# EAGLE design flightcontroller (EAGLE 9.5.2)
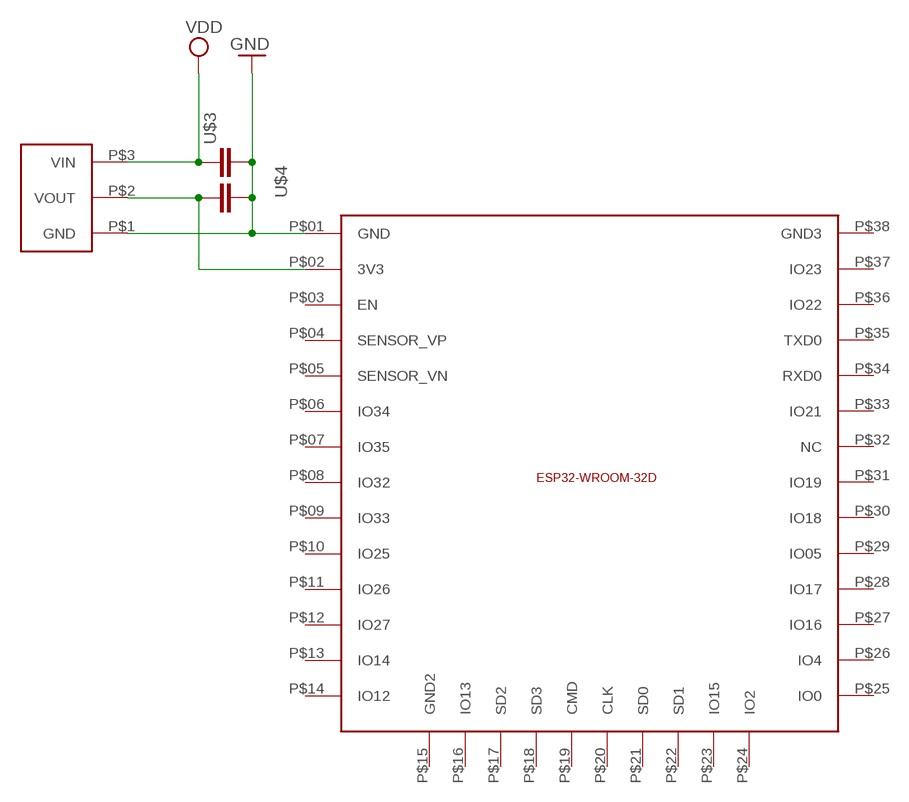
[diagram p0: schematic, sheet 1]

## Parts
U$1  ESP32  [ESP32-WROOM-32D]
U$2  REG1117  [REG1117]
U$3  C_TANTALUM-1411(3528-METRIC)  [CAPM3528X210]
U$4  C_TANTALUM-1411(3528-METRIC)  [CAPM3528X210]

## Nets
GND: U$1.P$01(GND) U$2.P$1(GND) U$3.2 U$4.2
N$2: U$1.P$02(3V3) U$2.P$2(VOUT) U$4.1
VDD: U$2.P$3(VIN) U$3.1
Unconnected: U$1.P$03(EN) U$1.P$04(SENSOR_VP) U$1.P$05(SENSOR_VN) U$1.P$06(IO34) U$1.P$07(IO35) U$1.P$08(IO32) U$1.P$09(IO33) U$1.P$10(IO25) U$1.P$11(IO26) U$1.P$12(IO27) U$1.P$13(IO14) U$1.P$14(IO12) U$1.P$15(GND2) U$1.P$16(IO13) U$1.P$17(SD2) U$1.P$18(SD3) U$1.P$19(CMD) U$1.P$20(CLK) U$1.P$21(SD0) U$1.P$22(SD1) U$1.P$23(IO15) U$1.P$24(IO2) U$1.P$25(IO0) U$1.P$26(IO4) U$1.P$27(IO16) U$1.P$28(IO17) U$1.P$29(IO05) U$1.P$30(IO18) U$1.P$31(IO19) U$1.P$32(NC) U$1.P$33(IO21) U$1.P$34(RXD0) U$1.P$35(TXD0) U$1.P$36(IO22) U$1.P$37(IO23) U$1.P$38(GND3)

## Library data of the parts
U$1 = FlightController:ESP32
U$2 = REG1117:REG1117
U$3 U$4 = Capacitor:C: Capacitor - Generic; CATEGORY: Capacitor

## Board
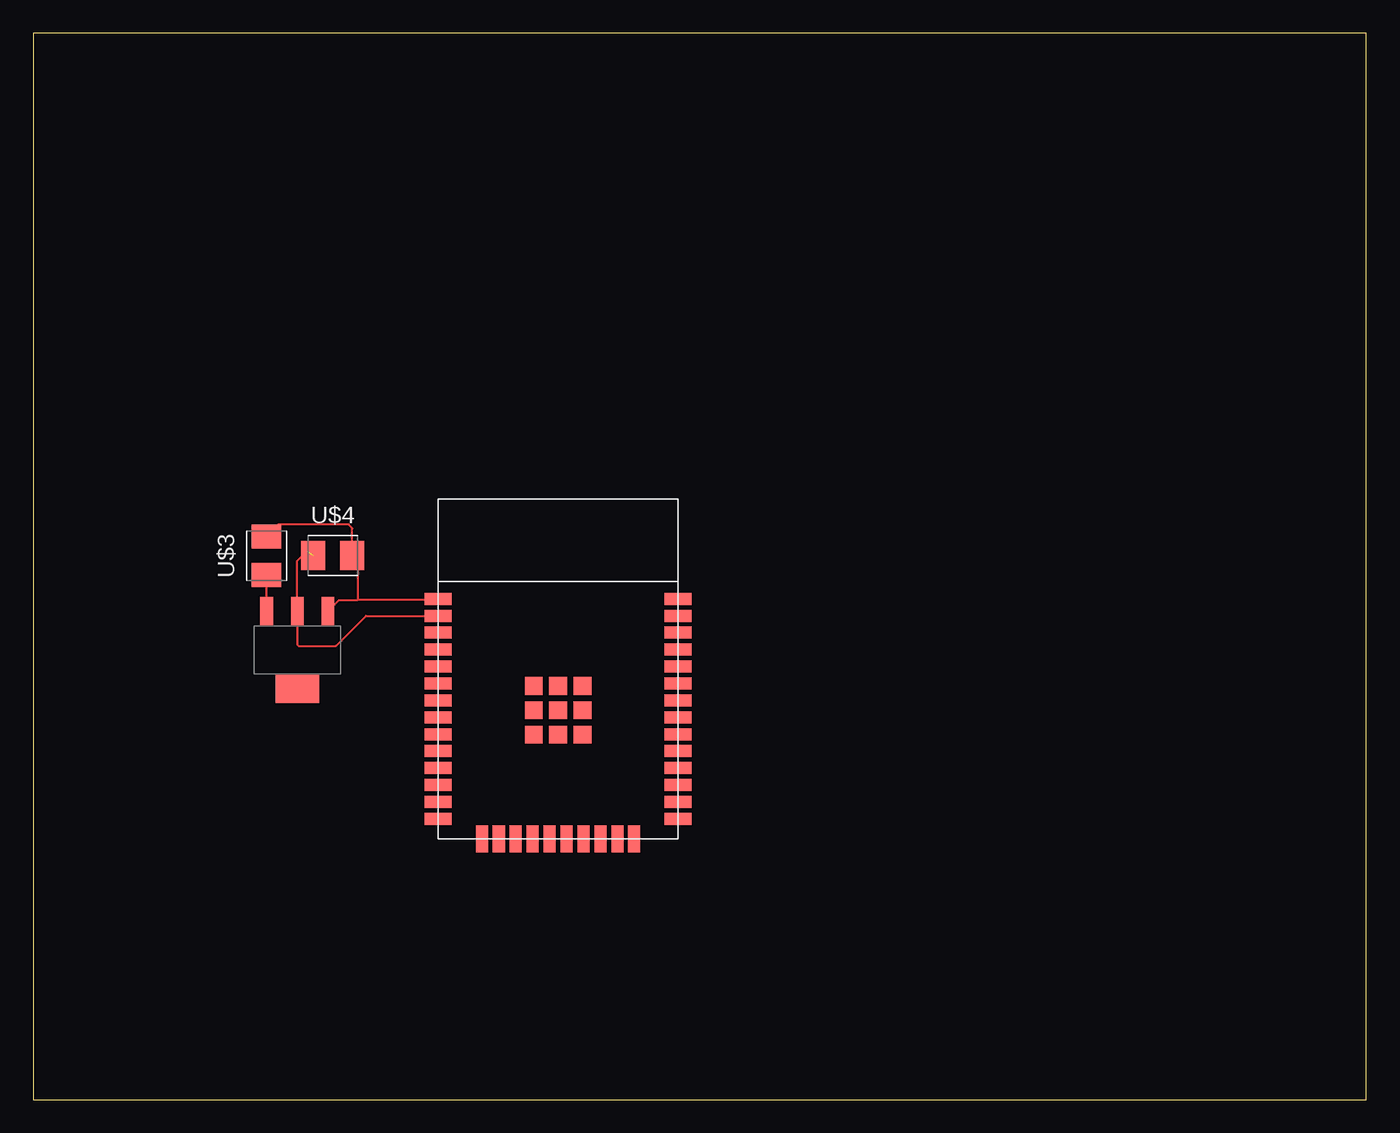
[diagram p1: board, top side]

Size 100 x 80 mm. Coordinates in mm from the lower left corner, seen from the top.
Outline: 0,0 100,0 100,80 0,80 0,0
Copper layers (1*16): Top 0.035mm / dielectric 1.5mm / Bottom 0.035mm
Design rules "default": minimum track width 6mil, minimum drill 0.35mm, track to track 6mil, track to pad 6mil, pad to pad 6mil, via to via 6mil, smd to smd 6mil, copper to edge 40mil, drill to drill 6mil, minimum pad ring 10mil, minimum via ring 8mil, stop-mask expansion 4mil, vias tented up to drill 0mil, thermal gap 10mil

### Footprints (pad centres in the part's own frame; a part is rotated, then mirrored left to right if it is on the bottom)
ESP32-WROOM-32D = smd 2 x 0.9: P$01 -9,8.36; P$02 -9,7.09; P$03 -9,5.82; P$04 -9,4.55; P$05 -9,3.28; P$06 -9,2.01; P$07 -9,0.74; P$08 -9,-0.53; P$09 -9,-1.8; P$10 -9,-3.07; P$11 -9,-4.34; P$12 -9,-5.61; P$13 -9,-6.88; P$14 -9,-8.15; P$25 9,-8.15; P$26 9,-6.88; P$27 9,-5.61; P$28 9,-4.34; P$29 9,-3.07; P$30 9,-1.8; P$31 9,-0.53; P$32 9,0.74; P$33 9,2.01; P$34 9,3.28; P$35 9,4.55; P$36 9,5.82; P$37 9,7.09; P$38 9,8.36 | smd 0.9 x 2: P$15 -5.715,-9.65; P$16 -4.445,-9.65; P$17 -3.175,-9.65; P$18 -1.905,-9.65; P$19 -0.635,-9.65; P$20 0.635,-9.65; P$21 1.905,-9.65; P$22 3.175,-9.65; P$23 4.445,-9.65; P$24 5.715,-9.65 | smd 1.33 x 1.33: P$40 0,0; P$41 0,1.83; P$42 1.83,0; P$43 1.83,1.83; P$44 -1.83,-1.83; P$45 -1.83,1.83; P$46 -1.83,0; P$47 0,-1.83; P$48 1.83,-1.83
REG1117 = smd 0.95 x 2.15: P$1 -2.3,-2.9; P$2 0,-2.9; P$3 2.3,-2.9 | smd 3.25 x 2.15: P$4 0,2.9
CAPM3528X210 = smd 1.796 x 2.204: 1 -1.46,0; 2 1.46,0

### Placement (x,y rotation side)
U$1  39.37,29.21 0 top
U$2  19.8,33.73 180 top
U$3  17.5,40.8 90 top
U$4  22.47,40.82 0 top

### Tracks (layer width: path | path; a pad name or v marks a point on that pad's centre or on a via)
GND
  Top 0.152: U$2.P$1 22.94,37.47 24.32,37.47 | U$1.P$01 30.27,37.47 24.32,37.47 | 24.32,37.47 24.32,40.43 U$4.2 23.93,42.84 23.95,42.86 23.66,43.15 18.39,43.15 U$3.2
N$2  (1 unrouted)
  Top 0.152: U$1.P$02 24.96,36.3 22.7,34.04 19.9,34.04 19.8,34.14 U$2.P$2 19.8,40.42 20.53,41.15
VDD
  Top 0.152: U$2.P$3 U$3.1